# Altium schematic sheet Connectors-Side.SchDoc: =ProjectTitle
size 297 x 209 mm; Address1: Address1; Address2: Address2; Address3: Address3; Address4: Address4; SheetNumber: 5; SheetTotal: 5; Scale: 1:1; DocumentType: Схема электрическая принципиальная
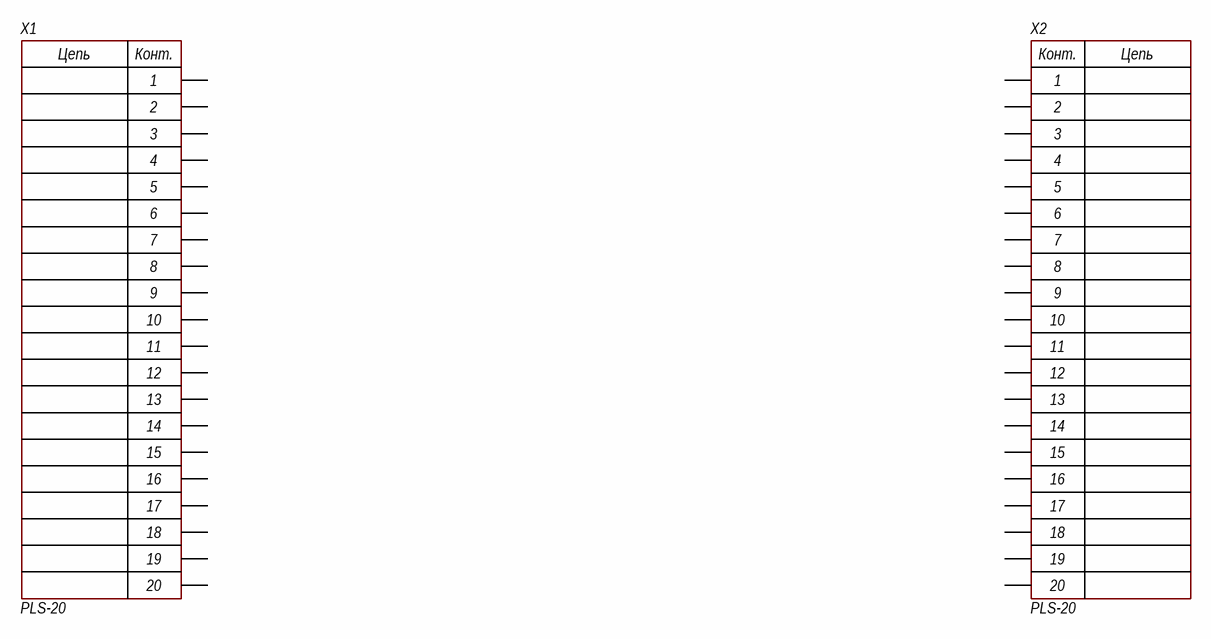
[diagram p0: Connectors-Side.SchDoc]

## Parts
X1  PLS-20  [CON: PLS-20]
X2  PLS-20  [CON: PLS-20]

## Nets

Not connected (* = marked no-connect by the designer): X1 1 2 3 4 5 6 7 8 9 10 11 12 13 14 15 16 17 18 19 20; X2 1 2 3 4 5 6 7 8 9 10 11 12 13 14 15 16 17 18 19 20

## Notes on the sheet
- Изм.
- Лист
- № докум.
- Подп.
- Дата
- Копировал
- Формат А4
- (in symbol 20-Connector) Конт.; Цепь

## Library data of the parts
X1 X2 = 20-Connector: Model: PLS-20; Manufacturer: *; HelpURL: *; ComponentKind: *